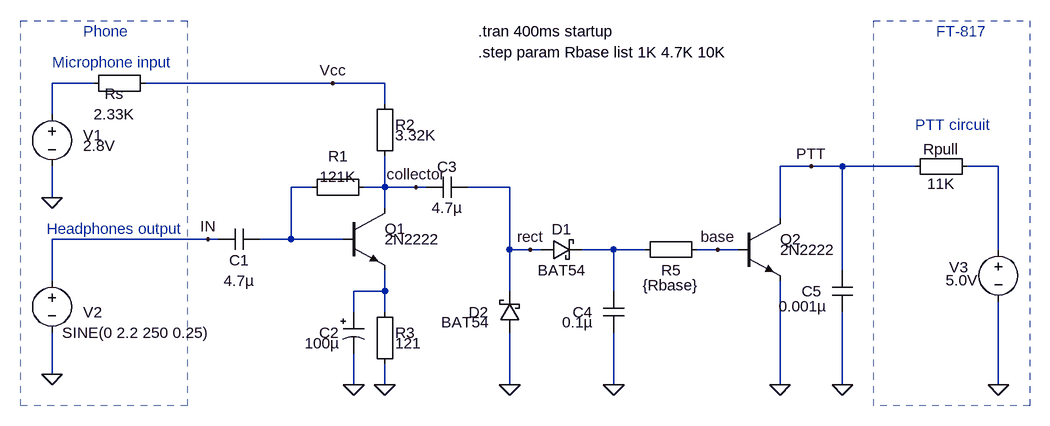
[diagram p0: schematic rtty_interface_bjt.asc]
rtty_interface_bjt.asc, the LTspice schematic file:
Version 4
SHEET 1 1856 680
WIRE -128 -192 -192 -192
WIRE 240 -192 -48 -192
WIRE 320 -192 240 -192
WIRE 320 -160 320 -192
WIRE -192 -144 -192 -192
WIRE 976 -64 928 -64
WIRE 1024 -64 976 -64
WIRE 1136 -64 1024 -64
WIRE 1264 -64 1216 -64
WIRE 208 -32 176 -32
WIRE 320 -32 320 -80
WIRE 320 -32 288 -32
WIRE 368 -32 320 -32
WIRE 384 -32 368 -32
WIRE 512 -32 448 -32
WIRE -192 -16 -192 -64
WIRE 320 0 320 -32
WIRE 928 16 928 -64
WIRE 48 48 -192 48
WIRE 64 48 48 48
WIRE 176 48 176 -32
WIRE 176 48 128 48
WIRE 256 48 176 48
WIRE 512 64 512 -32
WIRE 544 64 512 64
WIRE 560 64 544 64
WIRE 672 64 624 64
WIRE 720 64 672 64
WIRE 832 64 800 64
WIRE 864 64 832 64
WIRE 1264 64 1264 -64
WIRE 1024 96 1024 -64
WIRE -192 112 -192 48
WIRE 320 128 320 96
WIRE 320 128 272 128
WIRE 512 128 512 64
WIRE 672 128 672 64
WIRE 272 160 272 128
WIRE 320 160 320 128
WIRE -192 256 -192 192
WIRE 272 272 272 224
WIRE 320 272 320 240
WIRE 512 272 512 192
WIRE 672 272 672 192
WIRE 928 272 928 112
WIRE 1024 272 1024 160
WIRE 1264 272 1264 144
FLAG 320 272 0
FLAG -192 -16 0
FLAG 272 272 0
FLAG 512 272 0
FLAG 672 272 0
FLAG -192 256 0
FLAG 240 -192 Vcc
FLAG 48 48 IN
FLAG 928 272 0
FLAG 1264 272 0
FLAG 976 -64 PTT
FLAG 368 -32 collector
FLAG 544 64 rect
FLAG 1024 272 0
FLAG 832 64 base
SYMBOL voltage -192 -160 R0
WINDOW 0 48 48 Left 2
WINDOW 3 48 64 Left 2
WINDOW 123 0 0 Left 2
WINDOW 39 -81 91 Left 2
SYMATTR InstName V1
SYMATTR Value 2.8V
SYMBOL cap 64 64 R270
WINDOW 0 -32 32 VTop 2
WINDOW 3 -32 32 VBottom 2
SYMATTR InstName C1
SYMATTR Value 4.7µ
SYMATTR SpiceLine V=10 Irms=9.29 Rser=0.00646575 Lser=0 mfg="KEMET" pn="C0603C475K8PAC" type="X5R"
SYMBOL Misc\\EuropeanResistor 304 -48 R90
WINDOW 0 -16 56 VBottom 2
WINDOW 3 -16 56 VTop 2
SYMATTR InstName R1
SYMATTR Value 121K
SYMATTR SpiceLine tol=1 pwr=0.1
SYMBOL npn 256 0 R0
WINDOW 0 64 32 Left 2
WINDOW 3 64 48 Left 2
SYMATTR InstName Q1
SYMATTR Value 2N2222
SYMBOL Misc\\EuropeanResistor 304 -176 R0
WINDOW 0 32 48 Left 2
WINDOW 3 32 64 Left 2
SYMATTR InstName R2
SYMATTR Value 3.32K
SYMATTR SpiceLine tol=1 pwr=0.1
SYMBOL Misc\\EuropeanResistor 304 144 R0
WINDOW 0 32 48 Left 2
WINDOW 3 32 64 Left 2
SYMATTR InstName R3
SYMATTR Value 121
SYMATTR SpiceLine tol=1 pwr=0.1
SYMBOL polcap 256 160 R0
WINDOW 0 -6 32 Right 2
WINDOW 3 -5 48 Right 2
SYMATTR InstName C2
SYMATTR Value 100µ
SYMATTR SpiceLine V=6.3 Irms=0 Rser=0.9 Lser=0 mfg="AVX" pn="TAJD107M006" type="Tantalum"
SYMATTR Description Capacitor
SYMATTR Type cap
SYMBOL cap 384 -16 R270
WINDOW 0 32 32 VTop 2
WINDOW 3 0 32 VBottom 2
SYMATTR InstName C3
SYMATTR Value 4.7µ
SYMATTR SpiceLine V=10 Irms=9.29 Rser=0.00646575 Lser=0 mfg="KEMET" pn="C0603C475K8PAC" type="X5R"
SYMBOL cap 688 192 R180
WINDOW 0 48 32 Left 2
WINDOW 3 48 16 Left 2
SYMATTR InstName C4
SYMATTR Value 0.1µ
SYMATTR SpiceLine V=10 Irms=728m Rser=0.14361 Lser=0 mfg="KEMET" pn="C0603C104K8RAC" type="X7R"
SYMBOL schottky 560 80 R270
WINDOW 0 32 32 VTop 2
WINDOW 3 0 32 VBottom 2
SYMATTR InstName D1
SYMATTR Value BAT54
SYMATTR Description Diode
SYMATTR Type diode
SYMBOL schottky 528 192 R180
WINDOW 0 48 32 Left 2
WINDOW 3 48 16 Left 2
SYMATTR InstName D2
SYMATTR Value BAT54
SYMATTR Description Diode
SYMATTR Type diode
SYMBOL voltage -192 96 R0
WINDOW 0 48 64 Left 2
WINDOW 3 16 96 Left 2
WINDOW 123 0 0 Left 2
WINDOW 39 0 0 Left 2
SYMATTR InstName V2
SYMATTR Value SINE(0 2.2 250 0.25)
SYMBOL Misc\\EuropeanResistor -32 -208 R90
WINDOW 0 48 64 VBottom 2
WINDOW 3 48 64 VTop 2
SYMATTR InstName Rs
SYMATTR Value 2.33K
SYMBOL Misc\\EuropeanResistor 816 48 R90
WINDOW 0 32 55 VTop 2
WINDOW 3 55 56 VTop 2
SYMATTR InstName R5
SYMATTR Value {Rbase}
SYMATTR SpiceLine tol=1 pwr=0.1
SYMBOL voltage 1264 48 R0
WINDOW 0 -76 43 Left 2
WINDOW 3 -81 63 Left 2
WINDOW 123 0 0 Left 2
WINDOW 39 -81 91 Left 2
SYMATTR InstName V3
SYMATTR Value 5.0V
SYMBOL Misc\\EuropeanResistor 1232 -80 R90
WINDOW 0 5 56 VBottom 2
WINDOW 3 27 56 VTop 2
SYMATTR InstName Rpull
SYMATTR Value 11K
SYMATTR SpiceLine tol=1 pwr=0.1
SYMBOL cap 1040 160 R180
WINDOW 0 48 32 Left 2
WINDOW 3 40 9 Left 2
SYMATTR InstName C5
SYMATTR Value 0.001µ
SYMATTR SpiceLine V=10 Irms=40.9m Rser=5.11126 Lser=0 mfg="KEMET" pn="C0603C102K8RAC" type="X7R"
SYMBOL npn 864 16 R0
WINDOW 0 64 32 Left 2
WINDOW 3 64 48 Left 2
SYMATTR InstName Q2
SYMATTR Value 2N2222
TEXT 464 -272 Left 2 !.tran 400ms startup
TEXT 464 -240 Left 2 !.step param Rbase list 1K 4.7K 10K
TEXT 1168 -272 Left 2 ;FT-817
TEXT -144 -272 Left 2 ;Phone
TEXT -192 -224 Left 2 ;Microphone input
TEXT -200 32 Left 2 ;Headphones output
TEXT 1136 -128 Left 2 ;PTT circuit
RECTANGLE Normal 1312 304 1072 -288 1
RECTANGLE Normal 16 304 -240 -288 1

The netlist it stands for:
* rtty_interface_bjt.asc
V1 N001 0 2.8V
C1 IN N003 4.7µ V=10 Irms=9.29 Rser=0.00646575 Lser=0 mfg="KEMET" pn="C0603C475K8PAC" type="X5R"
R1 collector N003 121K tol=1 pwr=0.1
Q1 collector N003 N005 0 2N2222
R2 Vcc collector 3.32K tol=1 pwr=0.1
R3 N005 0 121 tol=1 pwr=0.1
C2 N005 0 100µ V=6.3 Irms=0 Rser=0.9 Lser=0 mfg="AVX" pn="TAJD107M006" type="Tantalum"
C3 collector rect 4.7µ V=10 Irms=9.29 Rser=0.00646575 Lser=0 mfg="KEMET" pn="C0603C475K8PAC" type="X5R"
C4 0 N004 0.1µ V=10 Irms=728m Rser=0.14361 Lser=0 mfg="KEMET" pn="C0603C104K8RAC" type="X7R"
D1 rect N004 BAT54
D2 0 rect BAT54
V2 IN 0 SINE(0 2.2 250 0.25)
Rs Vcc N001 2.33K
R5 base N004 {Rbase} tol=1 pwr=0.1
V3 N002 0 5.0V
Rpull N002 PTT 11K tol=1 pwr=0.1
C5 0 PTT 0.001µ V=10 Irms=40.9m Rser=5.11126 Lser=0 mfg="KEMET" pn="C0603C102K8RAC" type="X7R"
Q2 PTT base 0 0 2N2222
.model D D
.lib standard.dio
.model NPN NPN
.model PNP PNP
.lib standard.bjt
.tran 400ms startup
.step param Rbase list 1K 4.7K 10K
* FT-817
* Phone
* Microphone input
* Headphones output
* PTT circuit
.backanno
.end